# Altium schematic sheet FPGA_PWR.SchDoc: FPGA Power
size A4; Engineer: Samer Kilani; DocumentNumber: 2; SheetNumber: 2; SheetTotal: 9
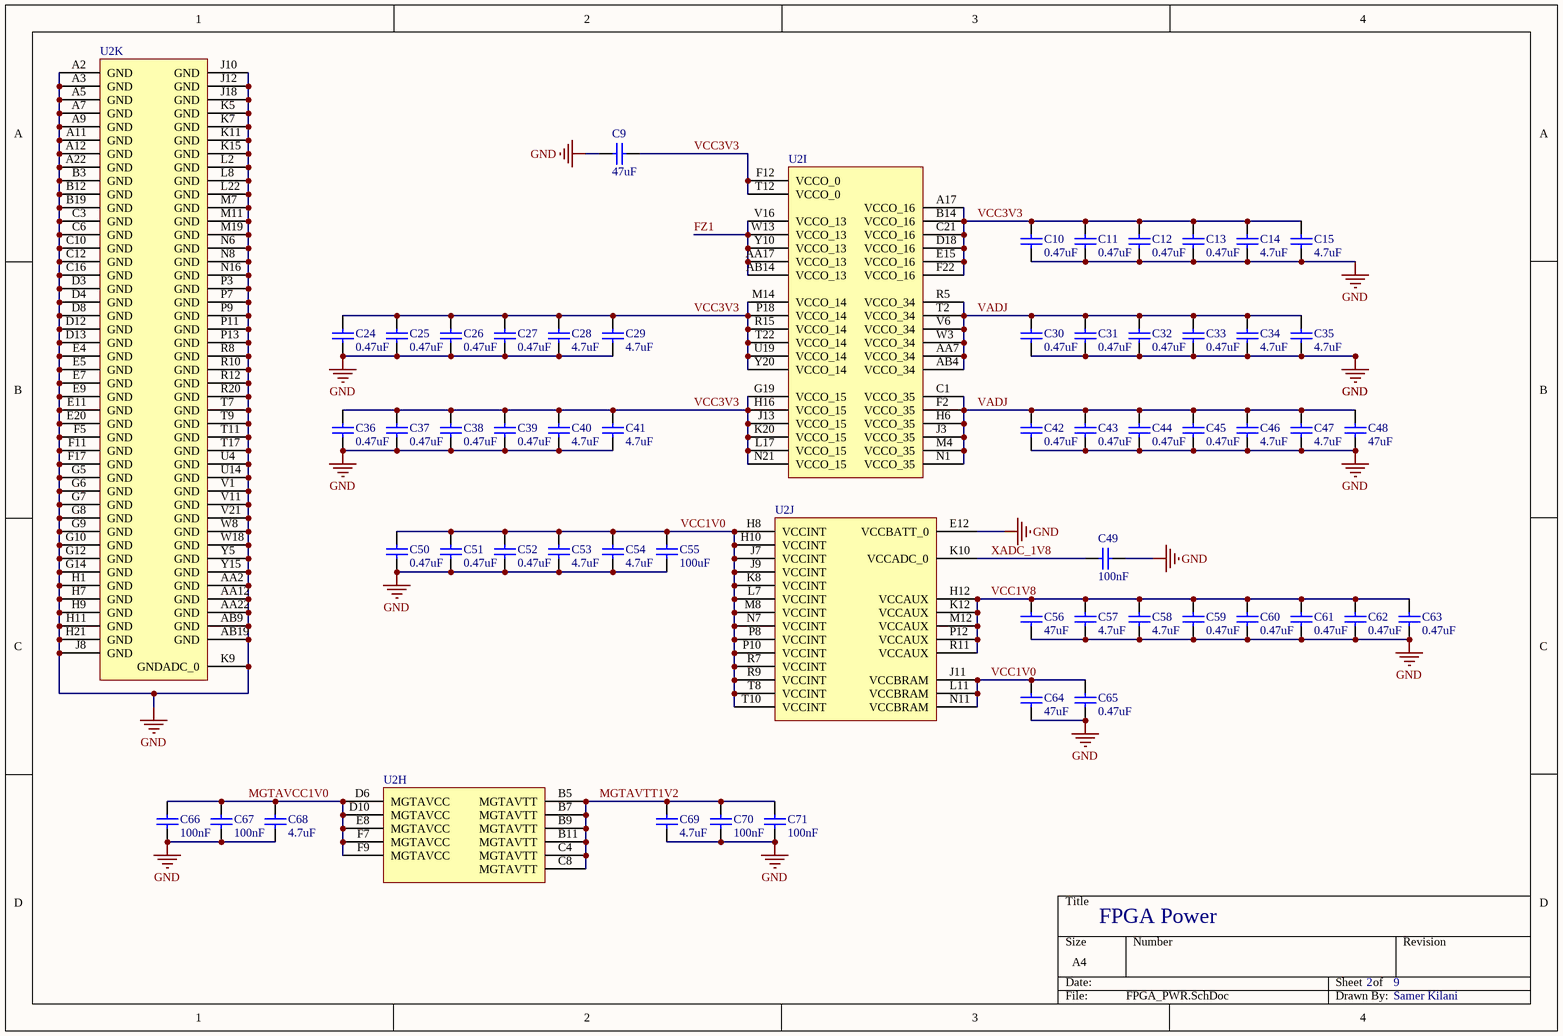
[diagram p0: FPGA_PWR.SchDoc]

## Parts
C9  value 47uF  [C1210]  (hidden comment: Cap)
C10  value 0.47uF  [C0402]  (hidden comment: Cap)
C11  value 0.47uF  [C0402]  (hidden comment: Cap)
C12  value 0.47uF  [C0402]  (hidden comment: Cap)
C13  value 0.47uF  [C0402]  (hidden comment: Cap)
C14  value 4.7uF  [C0805]  (hidden comment: Cap)
C15  value 4.7uF  [C0805]  (hidden comment: Cap)
C24  value 0.47uF  [C0402]  (hidden comment: Cap)
C25  value 0.47uF  [C0402]  (hidden comment: Cap)
C26  value 0.47uF  [C0402]  (hidden comment: Cap)
C27  value 0.47uF  [C0402]  (hidden comment: Cap)
C28  value 4.7uF  [C0805]  (hidden comment: Cap)
C29  value 4.7uF  [C0805]  (hidden comment: Cap)
C30  value 0.47uF  [C0402]  (hidden comment: Cap)
C31  value 0.47uF  [C0402]  (hidden comment: Cap)
C32  value 0.47uF  [C0402]  (hidden comment: Cap)
C33  value 0.47uF  [C0402]  (hidden comment: Cap)
C34  value 4.7uF  [C0805]  (hidden comment: Cap)
C35  value 4.7uF  [C0805]  (hidden comment: Cap)
C36  value 0.47uF  [C0402]  (hidden comment: Cap)
C37  value 0.47uF  [C0402]  (hidden comment: Cap)
C38  value 0.47uF  [C0402]  (hidden comment: Cap)
C39  value 0.47uF  [C0402]  (hidden comment: Cap)
C40  value 4.7uF  [C0805]  (hidden comment: Cap)
C41  value 4.7uF  [C0805]  (hidden comment: Cap)
C42  value 0.47uF  [C0402]  (hidden comment: Cap)
C43  value 0.47uF  [C0402]  (hidden comment: Cap)
C44  value 0.47uF  [C0402]  (hidden comment: Cap)
C45  value 0.47uF  [C0402]  (hidden comment: Cap)
C46  value 4.7uF  [C0805]  (hidden comment: Cap)
C47  value 4.7uF  [C0805]  (hidden comment: Cap)
C48  value 47uF  [C1210]  (hidden comment: Cap)
C49  value 100nF  [C0402]  (hidden comment: Cap)
C50  value 0.47uF  [C0402]  (hidden comment: Cap)
C51  value 0.47uF  [C0402]  (hidden comment: Cap)
C52  value 0.47uF  [C0402]  (hidden comment: Cap)
C53  value 4.7uF  [C0805]  (hidden comment: Cap)
C54  value 4.7uF  [C0805]  (hidden comment: Cap)
C55  value 100uF  [C1210]  (hidden comment: Cap)
C56  value 47uF  [C1210]  (hidden comment: Cap)
C57  value 4.7uF  [C0805]  (hidden comment: Cap)
C58  value 4.7uF  [C0805]  (hidden comment: Cap)
C59  value 0.47uF  [C0402]  (hidden comment: Cap)
C60  value 0.47uF  [C0402]  (hidden comment: Cap)
C61  value 0.47uF  [C0402]  (hidden comment: Cap)
C62  value 0.47uF  [C0402]  (hidden comment: Cap)
C63  value 0.47uF  [C0402]  (hidden comment: Cap)
C64  value 47uF  [C1210]  (hidden comment: Cap)
C65  value 0.47uF  [C0402]  (hidden comment: Cap)
C66  value 100nF  [C0402]  (hidden comment: Cap)
C67  value 100nF  [C0402]  (hidden comment: Cap)
C68  value 4.7uF  [C0805]  (hidden comment: Cap)
C69  value 4.7uF  [C0805]  (hidden comment: Cap)
C70  value 100nF  [C0402]  (hidden comment: Cap)
C71  value 100nF  [C0402]  (hidden comment: Cap)
U2  (no value)  [FGG484]  (parts H,I,J,K of 12)

## Nets
GND: C9.2 C10.2 C11.2 C12.2 C13.2 C14.2 C15.2 C24.2 C25.2 C26.2 C27.2 C28.2 C29.2 C30.2 C31.2 C32.2 C33.2 C34.2 C35.2 C36.2 C37.2 C38.2 C39.2 C40.2 C41.2 C42.2 C43.2 C44.2 C45.2 C46.2 C47.2 C48.2 C49.1 C50.2 C51.2 C52.2 C53.2 C54.2 C55.2 C56.2 C57.2 C58.2 C59.2 C60.2 C61.2 C62.2 C63.2 C64.2 C65.2 C66.2 C67.2 C68.2 C69.1 C70.1 C71.1 U2.A2(GND) U2.A3(GND) U2.A5(GND) U2.A7(GND) U2.A9(GND) U2.A11(GND) U2.A12(GND) U2.A22(GND) U2.AA2(GND) U2.AA12(GND) U2.AA22(GND) U2.AB9(GND) U2.AB19(GND) U2.B3(GND) U2.B12(GND) U2.B19(GND) U2.C3(GND) U2.C6(GND) U2.C10(GND) U2.C12(GND) U2.C16(GND) U2.D3(GND) U2.D4(GND) U2.D8(GND) U2.D12(GND) U2.D13(GND) U2.E4(GND) U2.E5(GND) U2.E7(GND) U2.E9(GND) U2.E11(GND) U2.E12(VCCBATT_0) U2.E20(GND) U2.F5(GND) U2.F11(GND) U2.F17(GND) U2.G5(GND) U2.G6(GND) U2.G7(GND) U2.G8(GND) U2.G9(GND) U2.G10(GND) U2.G12(GND) U2.G14(GND) U2.H1(GND) U2.H7(GND) U2.H9(GND) U2.H11(GND) U2.H21(GND) U2.J8(GND) U2.J10(GND) U2.J12(GND) U2.J18(GND) U2.K5(GND) U2.K7(GND) U2.K9(GNDADC_0) U2.K11(GND) U2.K15(GND) U2.L2(GND) U2.L8(GND) U2.L22(GND) U2.M7(GND) U2.M11(GND) U2.M19(GND) U2.N6(GND) U2.N8(GND) U2.N16(GND) U2.P3(GND) U2.P7(GND) U2.P9(GND) U2.P11(GND) U2.P13(GND) U2.R8(GND) U2.R10(GND) U2.R12(GND) U2.R20(GND) U2.T7(GND) U2.T9(GND) U2.T11(GND) U2.T17(GND) U2.U4(GND) U2.U14(GND) U2.V1(GND) U2.V11(GND) U2.V21(GND) U2.W8(GND) U2.W18(GND) U2.Y5(GND) U2.Y15(GND)
FZ1: U2.AA17(VCCO_13) U2.AB14(VCCO_13) U2.V16(VCCO_13) U2.W13(VCCO_13) U2.Y10(VCCO_13)
MGTAVCC1V0: C66.1 C67.1 C68.1 U2.D6(MGTAVCC) U2.D10(MGTAVCC) U2.E8(MGTAVCC) U2.F7(MGTAVCC) U2.F9(MGTAVCC)
MGTAVTT1V2: C69.2 C70.2 C71.2 U2.B5(MGTAVTT) U2.B7(MGTAVTT) U2.B9(MGTAVTT) U2.B11(MGTAVTT) U2.C4(MGTAVTT) U2.C8(MGTAVTT)
VADJ: C30.1 C31.1 C32.1 C33.1 C34.1 C35.1 C42.1 C43.1 C44.1 C45.1 C46.1 C47.1 C48.1 U2.AA7(VCCO_34) U2.AB4(VCCO_34) U2.C1(VCCO_35) U2.F2(VCCO_35) U2.H6(VCCO_35) U2.J3(VCCO_35) U2.M4(VCCO_35) U2.N1(VCCO_35) U2.R5(VCCO_34) U2.T2(VCCO_34) U2.V6(VCCO_34) U2.W3(VCCO_34)
VCC1V0: C50.1 C51.1 C52.1 C53.1 C54.1 C55.1 C64.1 C65.1 U2.H8(VCCINT) U2.H10(VCCINT) U2.J7(VCCINT) U2.J9(VCCINT) U2.J11(VCCBRAM) U2.K8(VCCINT) U2.L7(VCCINT) U2.L11(VCCBRAM) U2.M8(VCCINT) U2.N7(VCCINT) U2.N11(VCCBRAM) U2.P8(VCCINT) U2.P10(VCCINT) U2.R7(VCCINT) U2.R9(VCCINT) U2.T8(VCCINT) U2.T10(VCCINT)
VCC1V8: C56.1 C57.1 C58.1 C59.1 C60.1 C61.1 C62.1 C63.1 U2.H12(VCCAUX) U2.K12(VCCAUX) U2.M12(VCCAUX) U2.P12(VCCAUX) U2.R11(VCCAUX)
VCC3V3: C9.1 C10.1 C11.1 C12.1 C13.1 C14.1 C15.1 C24.1 C25.1 C26.1 C27.1 C28.1 C29.1 C36.1 C37.1 C38.1 C39.1 C40.1 C41.1 U2.A17(VCCO_16) U2.B14(VCCO_16) U2.C21(VCCO_16) U2.D18(VCCO_16) U2.E15(VCCO_16) U2.F12(VCCO_0) U2.F22(VCCO_16) U2.G19(VCCO_15) U2.H16(VCCO_15) U2.J13(VCCO_15) U2.K20(VCCO_15) U2.L17(VCCO_15) U2.M14(VCCO_14) U2.N21(VCCO_15) U2.P18(VCCO_14) U2.R15(VCCO_14) U2.T12(VCCO_0) U2.T22(VCCO_14) U2.U19(VCCO_14) U2.Y20(VCCO_14)
XADC_1V8: C49.2 U2.K10(VCCADC_0)

## Library data of the parts
C9-C15 C24-C71 = Cap: Capacitor; Published: 8-Jun-2000; LatestRevisionDate: 17-Jul-2002; LatestRevisionNote: Re-released for DXP Platform.; PackageReference: RAD-0.3; Publisher: Altium Limited; PackageDescription: Radial Cap, Thru-Hole; 2 Leads; 0.3 in Pin Spacing
U2 = XC7A35T-1FGG484C: Artix-7 FPGA, 250 User I/Os, 4 GTP, 484-Ball BGA, Speed Grade 1, Commercial Grade, Pb-Free; Manufacturer: Xilinx; Total Block RAM: 1800 Kb; GTP: 4; Clock Mgmt Tiles (CMTs): 5; Logic Cells: 33280; Available User I/O: 250; Speed Grades: 1; DatasheetVersion: v1.15; PackageVersion: Rev. 1.11; PackageReference: FGG484; PackageDescription: 484-Ball Wire-Bond Fine-Pitch BGA, Body 23 x 23 mm, Pitch 1 mm; Maximum Distributed RAM: 400 Kb; Operating Temperature Range: Commercial; NexusDeviceID: XC7A35T-1FGG484C; Mounting Technology: Surface Mount; PartNumber: XC7A35T-1FGG484C; ComponentLink1Description: Manufacturer URL; ComponentLink1URL: http://www.xilinx.com/; ComponentLink2Description: Datasheet; ComponentLink2URL: http://www.xilinx.com/support/documentation/data_sheets/ds180_7Series_Overview.pdf; ComponentLink3Description: Package Specification; ComponentLink3URL: http://www.xilinx.com/support/documentation/user_guides/ug475_7Series_Pkg_Pinout.pdf; ComponentLink4Description: DC and Switching Characteristics; ComponentLink4URL: http://www.xilinx.com/support/documentation/data_sheets/ds181_Artix_7_Data_Sheet.pdf; ComponentLink5Description: Package File; ComponentLink5URL: http://www.xilinx.com/support/packagefiles/a7packages/xc7a200tsbg484pkg.txt; ComponentLink6Description: Packaging and Pinout; ComponentLink6URL: http://www.xilinx.com/support/documentation/user_guides/ug475_7Series_Pkg_Pinout.pdf